# Altium schematic sheet Power.SchDoc
size A4
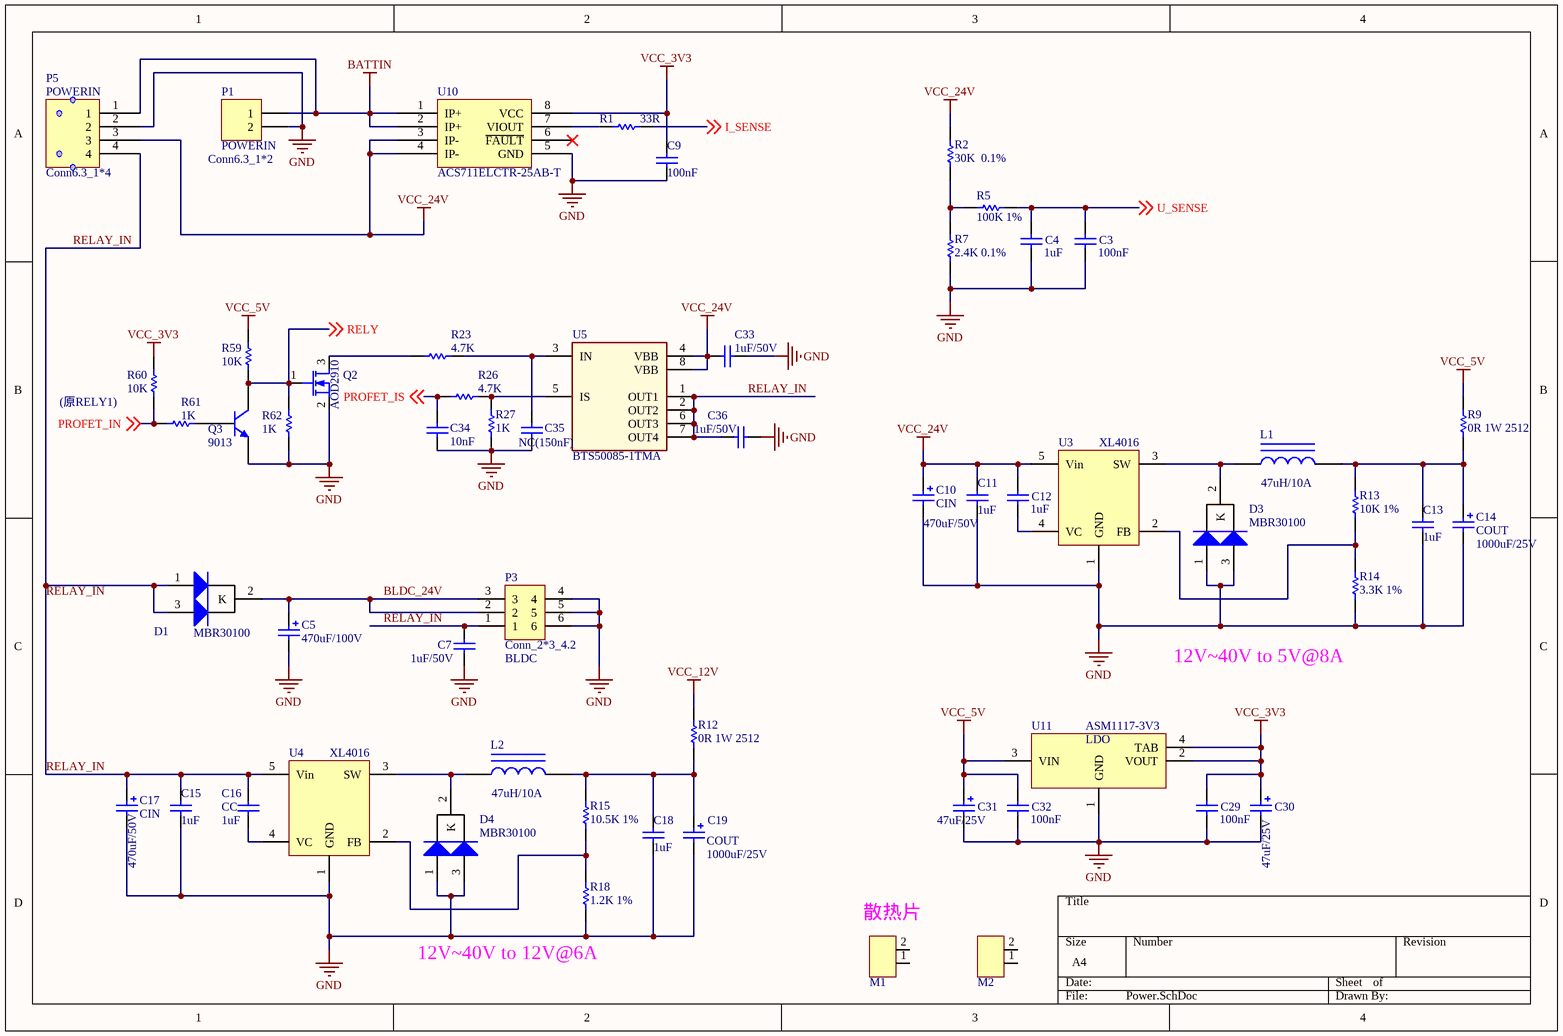
[diagram p0: Power.SchDoc]

## Parts
C3  value 100nF  [C0805]  (hidden comment: Cap)
C4  value 1uF  [C0805]  (hidden comment: Cap)
C5  value 470uF/100V  [330uF]  (hidden comment: Cap Pol1)
C7  value 1uF/50V  [C0805]  (hidden comment: Cap)
C9  value 100nF  [C0805]  (hidden comment: Cap)
C10  CIN  value 470uF/50V  [CTH-R5-D5]
C11  value 1uF  [C0805]  (hidden comment: Cap)
C12  value 1uF  [C0805]  (hidden comment: Cap)
C13  value 1uF  [C0805]  (hidden comment: Cap)
C14  COUT  value 1000uF/25V  [CTH-R5-D5]
C15  value 1uF  [C0805]  (hidden comment: Cap)
C16  value 1uF  [C0805]  (hidden comment: Cap)
C17  CIN  value 470uF/50V  [CTH-R5-D5]
C18  value 1uF  [C0805]  (hidden comment: Cap)
C19  COUT  value 1000uF/25V  [CTH-R5-D5]
C29  value 100nF  [C0805]  (hidden comment: Cap)
C30  value 47uF/25V  [CTH-R3-D2.54]  (hidden comment: Cap Pol1)
C31  value 47uF/25V  [CTH-R3-D2.54]  (hidden comment: Cap Pol1)
C32  value 100nF  [C0805]  (hidden comment: Cap)
C33  value 1uF/50V  [C0805]  (hidden comment: Cap)
C34  value 10nF  [C0805]  (hidden comment: Cap)
C35  value NC(150nF)  [C0805]  (hidden comment: Cap)
C36  value 1uF/50V  [C0805]  (hidden comment: Cap)
D1  MBR30100  [TO-263-3]
D3  MBR30100  [TO-263-3]
D4  MBR30100  [TO-263-3]
L1  value 47uH/10A  [L2210]  (hidden comment: Inductor Iron)
L2  value 47uH/10A  [L2210]  (hidden comment: Inductor Iron)
M1  SRP  [SRP-2-15*10]  (value not drawn)
M2  SRP  [SRP-2-15*10]  (value not drawn)
P1  POWERIN  [DIP2*6.3]
P3  Conn_2*3_4.2  Conn4.2: BLDC  [PIN2X3_4.2]
P5  POWERIN  [PORT-SIP4-6.3-LOCK]
Q2  AOD2910  [TO252-D]
Q3  9013  [BCY-W3/E4]
R1  value 33R  [R0805]  (hidden comment: Res1)
R2  value 30K  0.1%  [R0805]  (hidden comment: Res1)
R5  value 100K 1%  [R0805]  (hidden comment: Res1)
R7  value 2.4K 0.1%  [R0805]  (hidden comment: Res1)
R9  value 0R 1W 2512  [2512]  (hidden comment: Res1)
R12  value 0R 1W 2512  [2512]  (hidden comment: Res1)
R13  value 10K 1%  [R0805]  (hidden comment: Res1)
R14  value 3.3K 1%  [R0805]  (hidden comment: Res1)
R15  value 10.5K 1%  [R0805]  (hidden comment: Res1)
R18  value 1.2K 1%  [R0805]  (hidden comment: Res1)
R23  value 4.7K  [R0805]  (hidden comment: Res1)
R26  value 4.7K  [R0805]  (hidden comment: Res1)
R27  value 1K  [R0805]  (hidden comment: Res1)
R59  value 10K  [R0805]  (hidden comment: Res1)
R60  value 10K  [R0805]  (hidden comment: Res1)
R61  value 1K  [R0805]  (hidden comment: Res1)
R62  value 1K  [R0805]  (hidden comment: Res1)
U3  XL4016  [TO220-5]
U4  XL4016  [TO220-5]
U5  BTS50085-1TMA  [TO127P1385X450-8N-V]
U10  ACS711ELCTR-25AB-T  [ACS712-SOIC8]
U11  ASM1117-3V3  [ASM1117-3V3]

## Nets
BATTIN: P1.1 P5.1 U10.1(IP+) U10.2(IP+)
GND: C3.1 C4.1 C5.2 C7.2 C9.1 C10.2 C11.1 C13.1 C14.2 C15.1 C17.2 C18.1 C19.2 C29.1 C30.2 C31.2 C32.1 C33.1 C34.2 C35.2 C36.1 D3.1(A) D3.3(A) D4.1(A) D4.3(A) P1.2 P3.4 P3.5 P3.6 P5.2 Q2.2(S) Q3.1(E) R7.2 R14.2 R18.2 R27.1 R62.2 U3.1(GND) U4.1(GND) U10.5(GND) U11.1(GND)
VCC_3V3: C9.2 C29.2 C30.1 R60.1 U10.8(VCC) U11.2(VOUT) U11.4(TAB)
VCC_5V: C31.1 C32.2 R9.1 R59.1 U11.3(VIN)
VCC_12V: R12.1
VCC_24V: C10.1 C11.2 C12.2 C33.2 P5.3 R2.1 U3.5(Vin) U5.4(VBB) U5.8(VBB) U10.3(IP-) U10.4(IP-)
BLDC_24V: C5.1 D1.2(K) P3.2 P3.3
I_SENSE: R1.1 ; off-sheet I_SENSE
PROFET_IN: R60.2 R61.2 ; off-sheet PROFET_IN
PROFET_IS: C34.1 R26.1 ; off-sheet PROFET_IS
RELAY_IN: C7.1 C15.2 C16.2 C17.1 C36.2 D1.1(A) D1.3(A) P3.1 P5.4 U4.5(Vin) U5.1(OUT1) U5.2(OUT2) U5.6(OUT3) U5.7(OUT4)
RELY: Q2.1(G) Q3.3(C) R59.2 R62.1 ; off-sheet RELY
U_SENSE: C3.2 C4.2 R5.2 ; off-sheet U_SENSE
NetC12_1: C12.1 U3.4(VC)
NetC13_2: C13.2 C14.1 L1.2 R9.2 R13.1
NetC16_1: C16.1 U4.4(VC)
NetC18_2: C18.2 C19.1 L2.2 R12.2 R15.1
NetC35_1: C35.1 R23.2 U5.3(IN)
NetD3_2: D3.2(K) L1.1 U3.3(SW)
NetD4_2: D4.2(K) L2.1 U4.3(SW)
NetQ2_3: Q2.3(D) R23.1
NetQ3_2: Q3.2(B) R61.1
NetR1_2: R1.2 U10.7(VIOUT)
NetR2_2: R2.2 R5.1 R7.1
NetR13_2: R13.2 R14.1 U3.2(FB)
NetR15_2: R15.2 R18.1 U4.2(FB)
NetR26_2: R26.2 R27.2 U5.5(IS)

Not connected (* = marked no-connect by the designer): M1 1 2; M2 1 2; U10 6(~{FAULT})*

## Notes on the sheet
- (near P1) Conn6.3_1*2
- (原RELY1)
- 12V~40V to 5V@8A
- (near C16) CC
- (near M1) 散热片
- (near R18) 12V~40V to 12V@6A
- (in symbol CONN_4PIN) Conn6.3_1*4

## Library data of the parts
C3 C4 C7 C9 C11-C13 C15 C18 C29 C32-C36 = Cap: Capacitor; Published: 8-Jun-2000; LatestRevisionDate: 17-Jul-2002; LatestRevisionNote: Re-released for DXP Platform.; PackageReference: RAD-0.3; Publisher: Altium Limited; PackageDescription: Radial Cap, Thru-Hole; 2 Leads; 0.3 in Pin Spacing
C5 C10 C14 C17 C19 C30 C31 = Cap Pol1: Polarized Capacitor (Radial); Published: 8-Jun-2000; LatestRevisionDate: 17-Jul-2002; LatestRevisionNote: Re-released for DXP Platform.; PackageReference: RB7.6-15; Publisher: Altium Limited; PackageDescription: Polarized Capacitor (Radial); 2 Leads
C16 = Cap: CC; Published: 8-Jun-2000; LatestRevisionDate: 17-Jul-2002; LatestRevisionNote: Re-released for DXP Platform.; PackageReference: RAD-0.3; Publisher: Altium Limited; PackageDescription: Radial Cap, Thru-Hole; 2 Leads; 0.3 in Pin Spacing
D1 D3 D4 = MBR30100: Dual Diode; Published: 8-Jun-2000; LatestRevisionDate: 17-Jul-2002; LatestRevisionNote: Re-released for DXP Platform.; PackageVersion: Sep-1996; PackageReference: SMC; Publisher: Altium Limited; PackageDescription: DO-214-AB/SMC; 2 C-Bend Leads; Body 7.9 x 5.9 mm, inc. leads (LxW); Code_JEDEC: DO-214-AB
L1 L2 = Inductor Iron: Magnetic-Core Inductor; Published: 24-Mar-1999; LatestRevisionDate: 17-Jul-2002; LatestRevisionNote: Re-released for DXP Platform.; PackageReference: AXIAL-0.9; Publisher: Altium Limited; PackageDescription: Axial Device, Thru-Hole; 2 Leads; 0.9 in Pin Spacing
M1 M2 = SRP-1
P1 = Header 2: Conn6.3_1*2
P5 = CONN_4PIN
Q2 = MOSFET-N: N-Channel MOSFET; Published: 8-Jun-2000; LatestRevisionDate: 17-Jul-2002; LatestRevisionNote: Re-released for DXP Platform.; PackageVersion: 1995/1996; PackageReference: E3; Publisher: Altium Limited; Value: AOD2910
Q3 = 2N3904: NPN General Purpose Amplifier; Published: 8-Jun-2000; LatestRevisionDate: 15-Jan-2003; LatestRevisionNote: PCB Footprint 'BCY-W3/D4.7' replaced; DatasheetVersion: 1997; PackageVersion: Sep-1998; PackageReference: TO-92A; Publisher: Altium Limited; Code_JEDEC: TO-92A; ComponentLink1Description: Manufacturer Link; ComponentLink1URL: http://www.fairchildsemi.com/; ComponentLink2Description: Datasheet; ComponentLink2URL: http://www.fairchildsemi.com/ds/2N%2F2N3904.pdf
R1 R2 R5 R7 R9 R12-R15 R18 R23 R26 R27 R59-R62 = Res1: Resistor; Published: 8-Jun-2000; LatestRevisionDate: 17-Jul-2002; LatestRevisionNote: Re-released for DXP Platform.; PackageReference: AXIAL-0.3; Publisher: Altium Limited; PackageDescription: Axial Device, Thru-Hole; 2 Leads; 0.3 in Pin Spacing
U3 U4 = XL4016: BUCK DCDC; Published: 24-Mar-1999; LatestRevisionDate: 29-May-2009; LatestRevisionNote: IPC-7351 Footprint Added.; PackageReference: D2PAK; Publisher: Altium Limited; PackageDescription: 3-Pin Transistor Outline Package 2.54 mm Pitch, 15.1 mm Lead Span
U5 = BTS50085-1TMA: Smart Highside High Current Power Switch, VBB 70V; Manufacturer: Infineon Technologies; ManufacturerPartNumber: BTS50085-1TMA; PackageReference: PG-TO220-7-4
U10 = ACS711
U11 = LDO